# Altium schematic sheet IO.SchDoc
size A2; SPICEModelCacheUFEYCXMP: <root> / <DocumentId>UFEYCXMP</DocumentId> / </root>
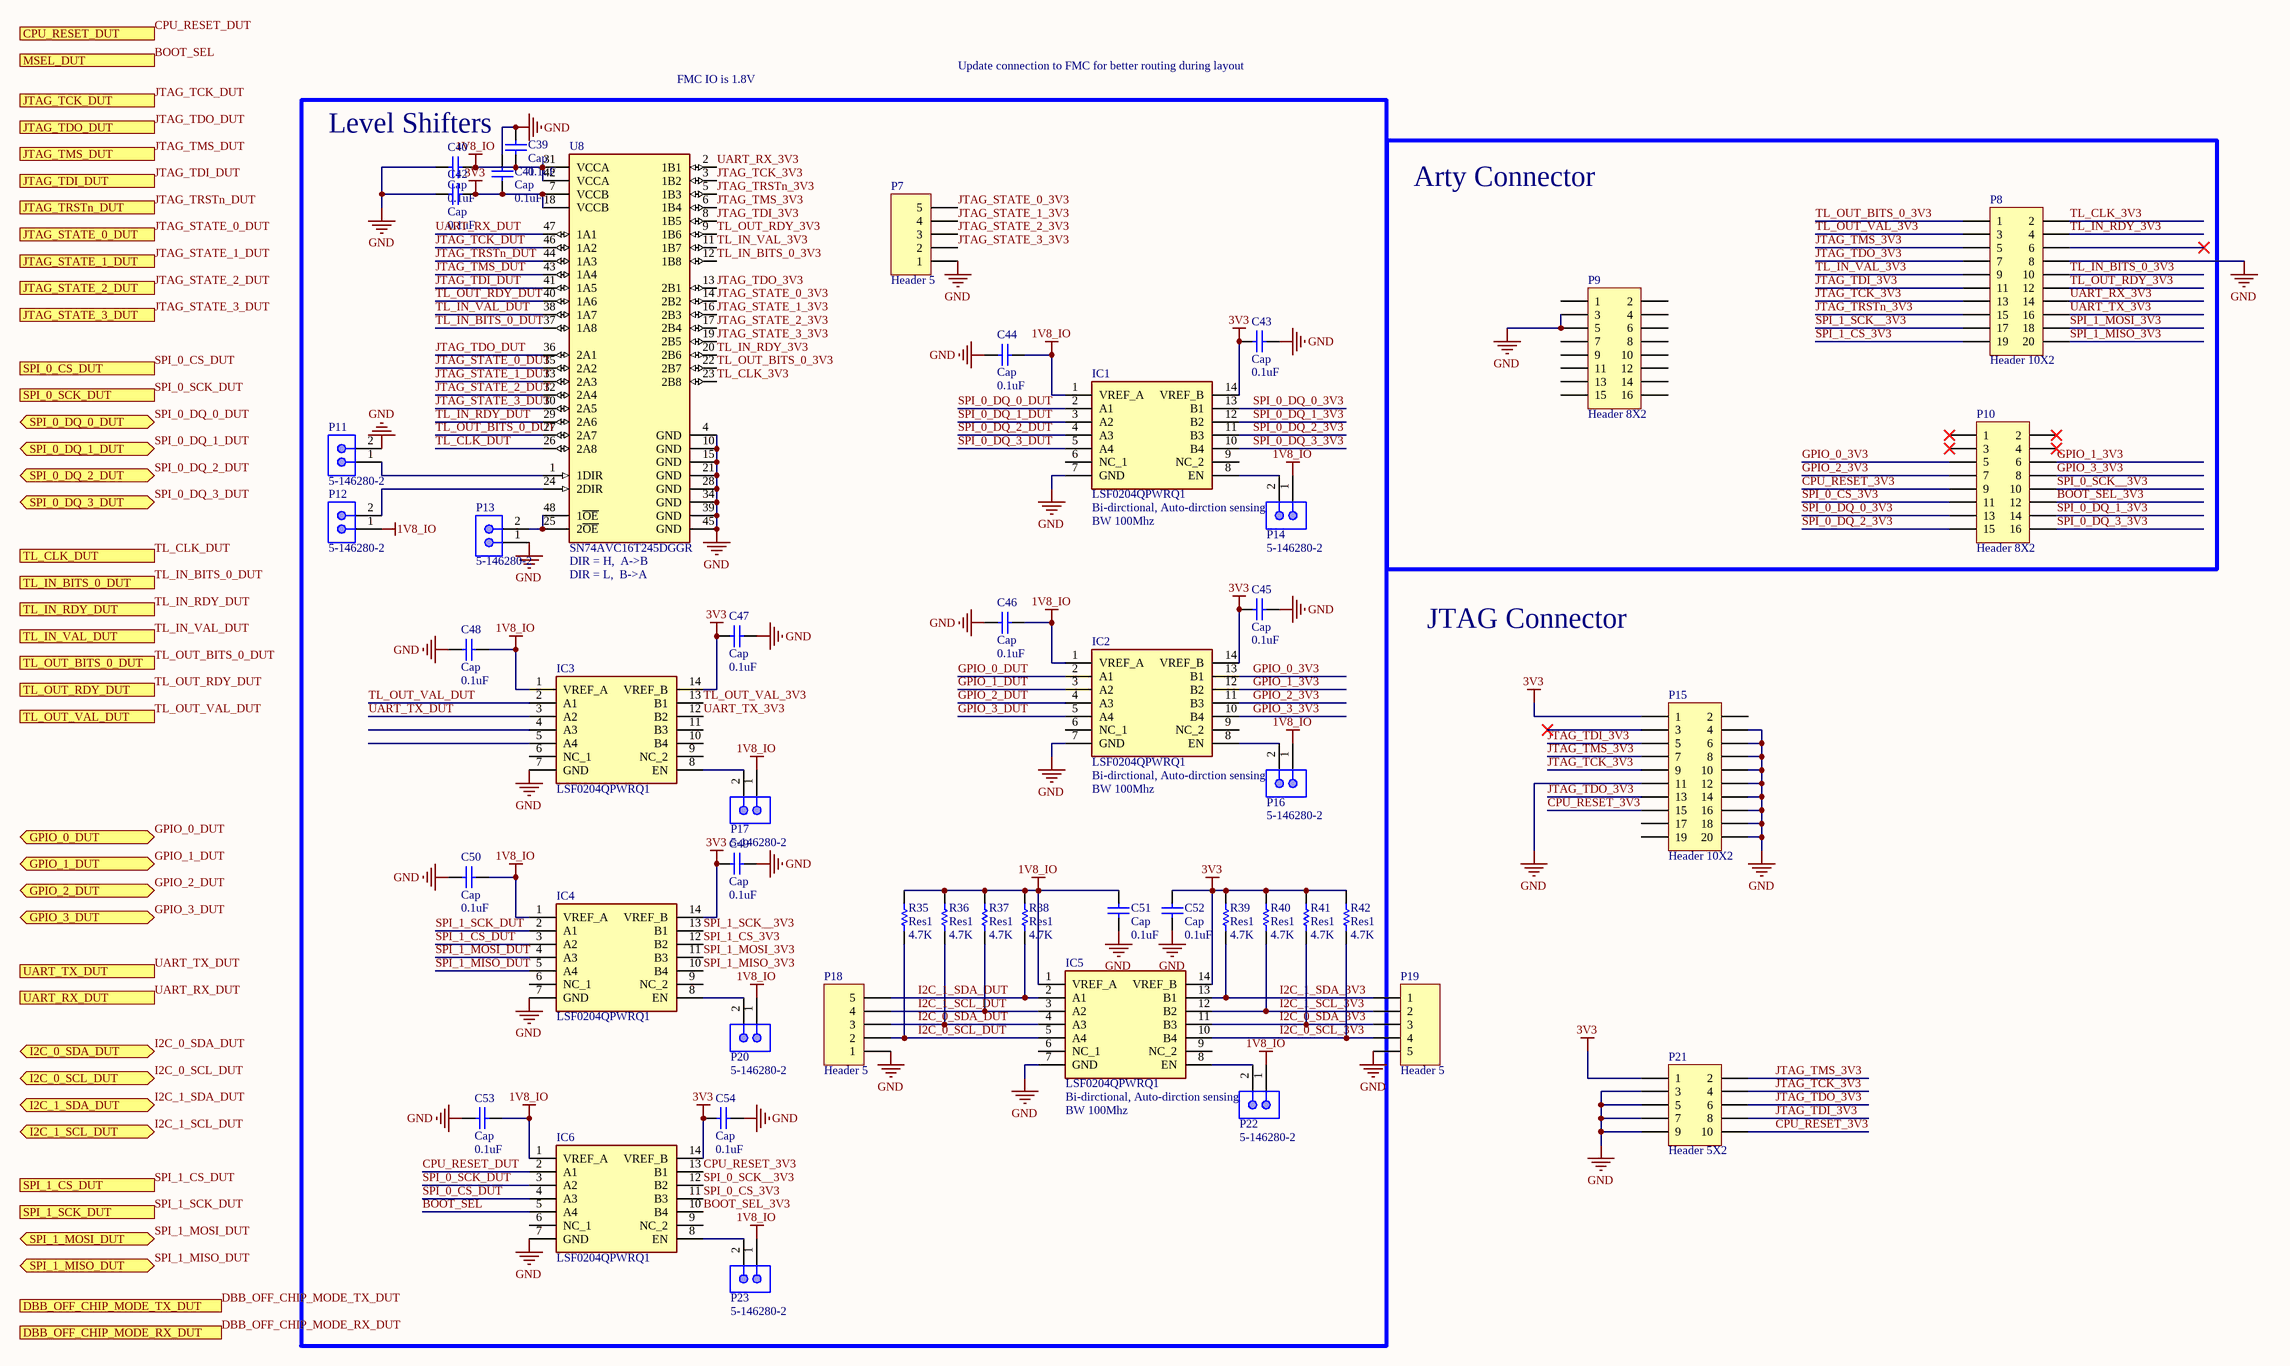
[diagram p0: IO.SchDoc]

## Parts
C39  Cap  value 0.1uF  [0603]
C40  Cap  value 0.1uF  [0603]
C41  Cap  value 0.1uF  [0603]
C42  Cap  value 0.1uF  [0603]
C43  Cap  value 0.1uF  [0603]
C44  Cap  value 0.1uF  [0603]
C45  Cap  value 0.1uF  [0603]
C46  Cap  value 0.1uF  [0603]
C47  Cap  value 0.1uF  [0603]
C48  Cap  value 0.1uF  [0603]
C49  Cap  value 0.1uF  [0603]
C50  Cap  value 0.1uF  [0603]
C51  Cap  value 0.1uF  [0603]
C52  Cap  value 0.1uF  [0603]
C53  Cap  value 0.1uF  [0603]
C54  Cap  value 0.1uF  [0603]
IC1  LSF0204QPWRQ1  [SOP65P640X120-14N]
IC2  LSF0204QPWRQ1  [SOP65P640X120-14N]
IC3  LSF0204QPWRQ1  [SOP65P640X120-14N]
IC4  LSF0204QPWRQ1  [SOP65P640X120-14N]
IC5  LSF0204QPWRQ1  [SOP65P640X120-14N]
IC6  LSF0204QPWRQ1  [SOP65P640X120-14N]
P7  Header 5  [HDR1X5]
P8  Header 10X2  [HDR2X10]
P9  Header 8X2  [HDR2X8]
P10  Header 8X2  [HDR2X8]
P11  5-146280-2  [TECO-5-146280-2_V]
P12  5-146280-2  [TECO-5-146280-2_V]
P13  5-146280-2  [TECO-5-146280-2_V]
P14  5-146280-2  [TECO-5-146280-2_V]
P15  Header 10X2  [HDR2X10]
P16  5-146280-2  [TECO-5-146280-2_V]
P17  5-146280-2  [TECO-5-146280-2_V]
P18  Header 5  [HDR1X5]
P19  Header 5  [HDR1X5]
P20  5-146280-2  [TECO-5-146280-2_V]
P21  Header 5X2  [HDR2X5]
P22  5-146280-2  [TECO-5-146280-2_V]
P23  5-146280-2  [TECO-5-146280-2_V]
R35  Res1  value 4.7K  [0603]
R36  Res1  value 4.7K  [0603]
R37  Res1  value 4.7K  [0603]
R38  Res1  value 4.7K  [0603]
R39  Res1  value 4.7K  [0603]
R40  Res1  value 4.7K  [0603]
R41  Res1  value 4.7K  [0603]
R42  Res1  value 4.7K  [0603]
U8  SN74AVC16T245DGGR  [FP-DGG0048A-IPC_B]

## Blocks framed on the sheet
Level Shifters: C39-C54 IC1-IC6 P7 P11-P14 P16-P18 P20 P22 P23 R35-R42 U8
Arty Connector: P8-P10

## Ports
CPU_RESET_DUT (out), DBB_OFF_CHIP_MODE_RX_DUT (in), DBB_OFF_CHIP_MODE_TX_DUT (in), GPIO_0_DUT (bidir), GPIO_1_DUT (bidir), GPIO_2_DUT (bidir), GPIO_3_DUT (bidir), I2C_0_SCL_DUT (bidir), I2C_0_SDA_DUT (bidir), I2C_1_SCL_DUT (bidir), I2C_1_SDA_DUT (bidir), JTAG_STATE_0_DUT (in), JTAG_STATE_1_DUT (in), JTAG_STATE_2_DUT (in), JTAG_STATE_3_DUT (in), JTAG_TCK_DUT (out), JTAG_TDI_DUT (out), JTAG_TDO_DUT (in), JTAG_TMS_DUT (out), JTAG_TRSTn_DUT (out), MSEL_DUT (out), SPI_0_CS_DUT (in), SPI_0_DQ_0_DUT (bidir), SPI_0_DQ_1_DUT (bidir), SPI_0_DQ_2_DUT (bidir), SPI_0_DQ_3_DUT (bidir), SPI_0_SCK_DUT (in), SPI_1_CS_DUT (in), SPI_1_MISO_DUT (bidir), SPI_1_MOSI_DUT (bidir), SPI_1_SCK_DUT (in), TL_CLK_DUT (in), TL_IN_BITS_0_DUT (out), TL_IN_RDY_DUT (in), TL_IN_VAL_DUT (out), TL_OUT_BITS_0_DUT (in), TL_OUT_RDY_DUT (out), TL_OUT_VAL_DUT (in), UART_RX_DUT (out), UART_TX_DUT (in)

## Nets
1V8_IO: C39.2 C40.1 C44.1 C46.1 C48.1 C50.1 C51.2 C53.1 IC1.1(VREF_A) IC2.1(VREF_A) IC3.1(VREF_A) IC4.1(VREF_A) IC5.1(VREF_A) IC6.1(VREF_A) P12.1 P14.1 P16.1 P17.1 P20.1 P22.1 P23.1 R35.2 R36.2 R37.2 R38.2 U8.31(VCCA) U8.42(VCCA)
3V3: C41.2 C42.1 C43.2 C45.2 C47.2 C49.2 C52.2 C54.2 IC1.14(VREF_B) IC2.14(VREF_B) IC3.14(VREF_B) IC4.14(VREF_B) IC5.14(VREF_B) IC6.14(VREF_B) P15.1 P21.1 R39.2 R40.2 R41.2 R42.2 U8.7(VCCB) U8.18(VCCB)
GND: C39.1 C40.2 C41.1 C42.2 C43.1 C44.2 C45.1 C46.2 C47.1 C48.2 C49.1 C50.2 C51.1 C52.1 C53.2 C54.1 IC1.7(GND) IC2.7(GND) IC3.7(GND) IC4.7(GND) IC5.7(GND) IC6.7(GND) P7.1 P8.8 P9.3 P9.5 P11.2 P13.1 P15.4 P15.6 P15.8 P15.10 P15.11 P15.12 P15.14 P15.16 P15.18 P15.20 P18.1 P19.5 P21.3 P21.5 P21.7 P21.9 U8.4(GND) U8.10(GND) U8.15(GND) U8.21(GND) U8.28(GND) U8.34(GND) U8.39(GND) U8.45(GND)
BOOT_SEL: IC6.5(A4) ; port MSEL_DUT
BOOT_SEL_3V3: IC6.10(B4) P10.12
CPU_RESET_3V3: IC6.13(B1) P10.9 P15.15 P21.10
CPU_RESET_DUT: IC6.2(A1) ; port CPU_RESET_DUT
DBB_OFF_CHIP_MODE_RX_DUT: port DBB_OFF_CHIP_MODE_RX_DUT
DBB_OFF_CHIP_MODE_TX_DUT: port DBB_OFF_CHIP_MODE_TX_DUT
GPIO_0_3V3: IC2.13(B1) P10.5
GPIO_0_DUT: IC2.2(A1) ; port GPIO_0_DUT
GPIO_1_3V3: IC2.12(B2) P10.6
GPIO_1_DUT: IC2.3(A2) ; port GPIO_1_DUT
GPIO_2_3V3: IC2.11(B3) P10.7
GPIO_2_DUT: IC2.4(A3) ; port GPIO_2_DUT
GPIO_3_3V3: IC2.10(B4) P10.8
GPIO_3_DUT: IC2.5(A4) ; port GPIO_3_DUT
I2C_0_SCL_3V3: IC5.10(B4) P19.4 R42.1
I2C_0_SCL_DUT: IC5.5(A4) P18.2 R35.1 ; port I2C_0_SCL_DUT
I2C_0_SDA_3V3: IC5.11(B3) P19.3 R41.1
I2C_0_SDA_DUT: IC5.4(A3) P18.3 R36.1 ; port I2C_0_SDA_DUT
I2C_1_SCL_3V3: IC5.12(B2) P19.2 R40.1
I2C_1_SCL_DUT: IC5.3(A2) P18.4 R37.1 ; port I2C_1_SCL_DUT
I2C_1_SDA_3V3: IC5.13(B1) P19.1 R39.1
I2C_1_SDA_DUT: IC5.2(A1) P18.5 R38.1 ; port I2C_1_SDA_DUT
JTAG_STATE_0_3V3: P7.5 U8.14(2B2)
JTAG_STATE_0_DUT: U8.35(2A2) ; port JTAG_STATE_0_DUT
JTAG_STATE_1_3V3: P7.4 U8.16(2B3)
JTAG_STATE_1_DUT: U8.33(2A3) ; port JTAG_STATE_1_DUT
JTAG_STATE_2_3V3: P7.3 U8.17(2B4)
JTAG_STATE_2_DUT: U8.32(2A4) ; port JTAG_STATE_2_DUT
JTAG_STATE_3_3V3: P7.2 U8.19(2B5)
JTAG_STATE_3_DUT: U8.30(2A5) ; port JTAG_STATE_3_DUT
JTAG_TCK_3V3: P8.13 P15.9 P21.4 U8.3(1B2)
JTAG_TCK_DUT: U8.46(1A2) ; port JTAG_TCK_DUT
JTAG_TDI_3V3: P8.11 P15.5 P21.8 U8.8(1B5)
JTAG_TDI_DUT: U8.41(1A5) ; port JTAG_TDI_DUT
JTAG_TDO_3V3: P8.7 P15.13 P21.6 U8.13(2B1)
JTAG_TDO_DUT: U8.36(2A1) ; port JTAG_TDO_DUT
JTAG_TMS_3V3: P8.5 P15.7 P21.2 U8.6(1B4)
JTAG_TMS_DUT: U8.43(1A4) ; port JTAG_TMS_DUT
JTAG_TRSTn_3V3: P8.15 U8.5(1B3)
JTAG_TRSTn_DUT: U8.44(1A3) ; port JTAG_TRSTn_DUT
SPI_0_CS_3V3: IC6.11(B3) P10.11
SPI_0_CS_DUT: IC6.4(A3) ; port SPI_0_CS_DUT
SPI_0_DQ_0_3V3: IC1.13(B1) P10.13
SPI_0_DQ_0_DUT: IC1.2(A1) ; port SPI_0_DQ_0_DUT
SPI_0_DQ_1_3V3: IC1.12(B2) P10.14
SPI_0_DQ_1_DUT: IC1.3(A2) ; port SPI_0_DQ_1_DUT
SPI_0_DQ_2_3V3: IC1.11(B3) P10.15
SPI_0_DQ_2_DUT: IC1.4(A3) ; port SPI_0_DQ_2_DUT
SPI_0_DQ_3_3V3: IC1.10(B4) P10.16
SPI_0_DQ_3_DUT: IC1.5(A4) ; port SPI_0_DQ_3_DUT
SPI_0_SCK__3V3: IC6.12(B2) P10.10
SPI_0_SCK_DUT: IC6.3(A2) ; port SPI_0_SCK_DUT
SPI_1_CS_3V3: IC4.12(B2) P8.19
SPI_1_CS_DUT: IC4.3(A2) ; port SPI_1_CS_DUT
SPI_1_MISO_3V3: IC4.10(B4) P8.20
SPI_1_MISO_DUT: IC4.5(A4) ; port SPI_1_MISO_DUT
SPI_1_MOSI_3V3: IC4.11(B3) P8.18
SPI_1_MOSI_DUT: IC4.4(A3) ; port SPI_1_MOSI_DUT
SPI_1_SCK__3V3: IC4.13(B1) P8.17
SPI_1_SCK_DUT: IC4.2(A1) ; port SPI_1_SCK_DUT
TL_CLK_3V3: P8.2 U8.23(2B8)
TL_CLK_DUT: U8.26(2A8) ; port TL_CLK_DUT
TL_IN_BITS_0_3V3: P8.10 U8.12(1B8)
TL_IN_BITS_0_DUT: U8.37(1A8) ; port TL_IN_BITS_0_DUT
TL_IN_RDY_3V3: P8.4 U8.20(2B6)
TL_IN_RDY_DUT: U8.29(2A6) ; port TL_IN_RDY_DUT
TL_IN_VAL_3V3: P8.9 U8.11(1B7)
TL_IN_VAL_DUT: U8.38(1A7) ; port TL_IN_VAL_DUT
TL_OUT_BITS_0_3V3: P8.1 U8.22(2B7)
TL_OUT_BITS_0_DUT: U8.27(2A7) ; port TL_OUT_BITS_0_DUT
TL_OUT_RDY_3V3: P8.12 U8.9(1B6)
TL_OUT_RDY_DUT: U8.40(1A6) ; port TL_OUT_RDY_DUT
TL_OUT_VAL_3V3: IC3.13(B1) P8.3
TL_OUT_VAL_DUT: IC3.2(A1) ; port TL_OUT_VAL_DUT
UART_RX_3V3: P8.14 U8.2(1B1)
UART_RX_DUT: U8.47(1A1) ; port UART_RX_DUT
UART_TX_3V3: IC3.12(B2) P8.16
UART_TX_DUT: IC3.3(A2) ; port UART_TX_DUT
NetIC1_8: IC1.8(EN) P14.2
NetIC2_8: IC2.8(EN) P16.2
NetIC3_8: IC3.8(EN) P17.2
NetIC4_8: IC4.8(EN) P20.2
NetIC5_8: IC5.8(EN) P22.2
NetIC6_8: IC6.8(EN) P23.2
NetP11_1: P11.1 U8.1(1DIR)
NetP12_2: P12.2 U8.24(2DIR)
NetP13_2: P13.2 U8.25(2~{OE}) U8.48(1~{OE})

Not connected (* = marked no-connect by the designer): IC1 6(NC_1) 9(NC_2); IC2 6(NC_1) 9(NC_2); IC3 4(A3) 5(A4) 6(NC_1) 9(NC_2) 10(B4) 11(B3); IC4 6(NC_1) 9(NC_2); IC5 6(NC_1) 9(NC_2); IC6 6(NC_1) 9(NC_2); P8 6*; P9 1 2 4 6 7 8 9 10 11 12 13 14 15 16; P10 1* 2* 3* 4*; P15 2 3* 17 19

## Notes on the sheet
- FMC IO is 1.8V
- Update connection to FMC for better routing during layout
- (near U8) DIR = H,  A->B
- (near P14) Bi-dirctional, Auto-dirction sensing
- (near IC1) BW 100Mhz
- (near U8) DIR = L,  B->A
- JTAG Connector
- (near P16) Bi-dirctional, Auto-dirction sensing
- (near IC2) BW 100Mhz
- (near P22) Bi-dirctional, Auto-dirction sensing
- (near IC5) BW 100Mhz

## Library data of the parts
C39-C54 = Cap: Capacitor; Published: 8-Jun-2000; LatestRevisionDate: 17-Jul-2002; LatestRevisionNote: Re-released for DXP Platform.; PackageReference: RAD-0.3; Publisher: Altium Limited; PackageDescription: Radial Cap, Thru-Hole; 2 Leads; 0.3 in Pin Spacing
IC1-IC6 = CMP-016-000005-1: Automotive 4-Bit Bidirectional Multi-Voltage Level Translator for Open-Drain or Push- Pull Interface; Manufacturer_Name: Texas Instruments; Manufacturer_Part_Number: LSF0204QPWRQ1; Mouser Part Number: 595-LSF0204QPWRQ1; Arrow Part Number: LSF0204QPWRQ1; Design Item ID: LSF0204QPWRQ1; Datasheet Link: http://www.ti.com/lit/gpn/lsf0204-q1; Height: 1.2mm; Mouser Price/Stock: https://www.mouser.co.uk/ProductDetail/Texas-Instruments/LSF0204QPWRQ1?qs=w%2Fv1CP2dgqqt88p%2F1xId1A%3D%3D; Source: SamacSys.SchLib; Arrow Price/Stock: https://www.arrow.com/en/products/lsf0204qpwrq1/texas-instruments?region=nac
P7 P18 P19 = Header 5: Header, 5-Pin; LatestRevisionDate: 17-Jul-2002; LatestRevisionNote: Re-released for DXP Platform.; Publisher: Altium Limited
P8 P15 = Header 10X2: Header, 10-Pin, Dual row; LatestRevisionDate: 17-Jul-2002; LatestRevisionNote: Re-released for DXP Platform.; Publisher: Altium Limited
P9 P10 = Header 8X2: Header, 8-Pin, Dual row; LatestRevisionDate: 17-Jul-2002; LatestRevisionNote: Re-released for DXP Platform.; Publisher: Altium Limited
P11-P14 P16 P17 P20 P22 P23 = CMP-2000-07492-1: Male Header, Pitch 2.54 mm, 1 x 2 Position, Height 8.21 mm, Tail Length 3.05 mm, -65 to 105 degC, RoHS, Bulk; Manufacturer: TE Connectivity; Mating Connector Lock: No(Without); Number of Positions: 2; Pitch: 2.54mm; PCB Mounting Orientation: Vertical; Keyed: No; Case\/Package: 100; Mating Post Length: 0.23inch; High Temperature Housing: Yes; Max Current Rating: 5A; PCB Thickness: 0.063inch; PCB Mount Retention: Without; Approvals: CSA; Current Rating: 3A; Radiation Hardening: No; Length: 4.67mm; Contact Mating Length: 0.23inch; Connector Type: Header; Number of Rows: 1; Termination Post Length: 0.12inch; Board Standoff: No(Without); Max Operating Temperature: 105degC; Contact Shape: Square; Selectively Loaded: No(Without); Gasket: No(Without); Number of Contacts: 2; Contact Gender: Male; Mating Alignment: No(Without); Manufacturer URL: http://www.te.com/; Datasheet URL: http://www.te.com/commerce/DocumentDelivery/DDEController?Action=showdoc&DocId=Customer+Drawing%7F146280%7FH1%7Fpdf%7FEnglish%7FENG_CD_146280_H1.pdf%7F5-146280-2; Mount: ThroughHole; Orientation: Straight; Packaging: Carton; Package Reference: 5-146280-2; Package Quantity: 500; Stabilizers: No(Without); Row Spacing: 2.54mm; Contact Material: CopperAlloy; Panel Mount Retention: No(Without); Datasheet Version: Rev. H1, 08/2016; Housing Colour: Black; Colour: Black; Package Description: Male Header, Pitch 2.54 mm, 1 x 2 Position, Height 8.21 mm, Tail Length 3.05 mm; Contact Plating: Matte; Housing Material: Polymer; Contact Protection: No(Without); Min Operating Temperature: -65degC; Mounting Technology: ThroughHole; Flammability Rating: UL94V-0; RoHSCompliant: true; Termination: ThroughHole; Depth: 2.34mm; High Speed Serial Data Connector: No
P21 = Header 5X2: Header, 5-Pin, Dual row; LatestRevisionDate: 17-Jul-2002; LatestRevisionNote: Re-released for DXP Platform.; Publisher: Altium Limited
R35-R42 = Res1: Resistor; Published: 8-Jun-2000; LatestRevisionDate: 17-Jul-2002; LatestRevisionNote: Re-released for DXP Platform.; PackageReference: AXIAL-0.3; Publisher: Altium Limited; PackageDescription: Axial Device, Thru-Hole; 2 Leads; 0.3 in Pin Spacing
U8 = CMP-04899-000056-1: IC TRNSLTR BIDIRECTIONAL 48TSSOP; Max Supply Voltage: 3.6V; Min Supply Voltage: 1.2V; Number of Channels: 2; Turn-On Delay Time: 5ns; Data Rate: 380Mbps; Logic Function: Translator; High Level Output Current: -12mA; Propagation Delay: 2.7ns; Polarity: Non-Inverting; Low Level Output Current: 12mA; Number of Bits: 16; Package Quantity: 1; Case/Package: TSSOP; Contact Plating: Gold; Length: 12.6mm; Number of Elements: 2; Mount: Surface Mount; Weight: 0.007873oz; Lead Free: Lead Free; Width: 6.2mm; Number of Pins: 48; Direction: Bidirectional; Min Operating Temperature: -40°C; REACH SVHC: No SVHC; Packaging: Tape and Reel; Max Operating Temperature: 85°C; Height: 1.05mm; RoHS Compliant: Yes; Radiation Hardening: No